# Altium schematic sheet Sheet2.SchDoc
size A; SheetNumber: 1; SheetTotal: 2
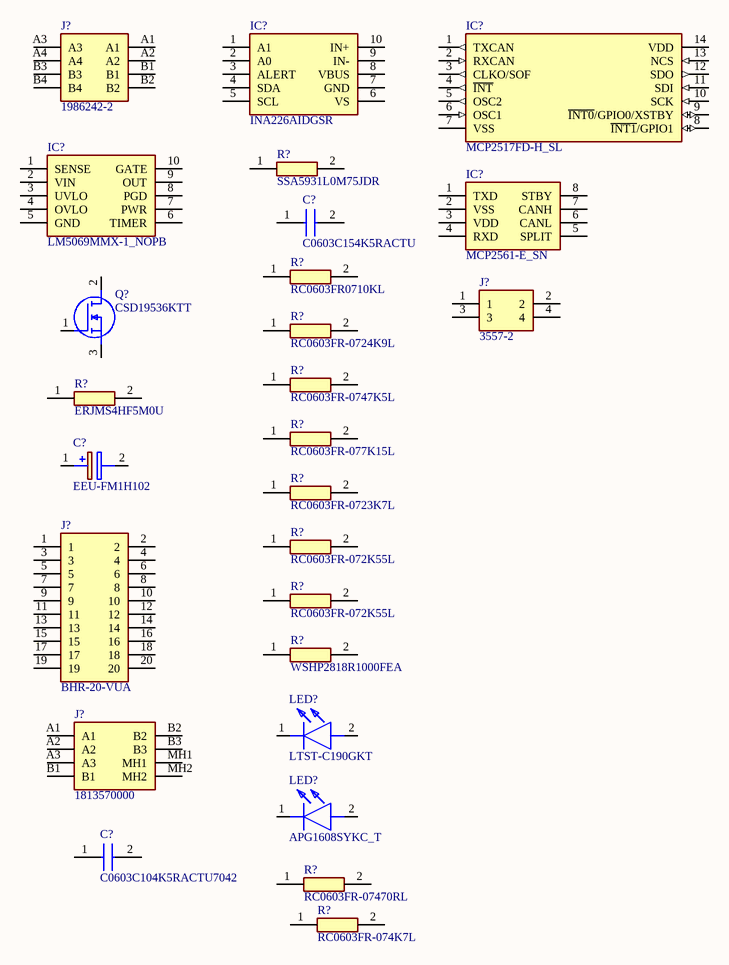
[diagram p0: Sheet2.SchDoc]

## Parts
(Parts that share a designator on the sheet are numbered #1, #2 ... from top to bottom, then left to right.)
C?#1  C0603C154K5RACTU  [C0603]
C?#2  EEU-FM1H102  [CAPPRD750W85D1600H2700]
C?#3  C0603C104K5RACTU7042  [CAPC1608X95N]
IC?#1  INA226AIDGSR  [SOP50P490X110-10N]
IC?#2  MCP2517FD-H_SL  [SOIC127P600X175-14N]
IC?#3  LM5069MMX-1_NOPB  [SOP50P490X110-10N]
IC?#4  MCP2561-E_SN  [SOIC127P600X175-8N]
J?#1  1986242-2  [19862422]
J?#2  3557-2  [3557-2]
J?#3  BHR-20-VUA  [SHDR20W64P254_2X10_3300X880X910P]
J?#4  1813570000  [1813570000]
LED?#1  LTST-C190GKT  [LEDC1608X90N]
LED?#2  APG1608SYKC_T  [APG1608SYKCT]
Q?  CSD19536KTT  [CSD19536KTTT]
R?#1  SSA5931L0M75JDR  [SSA5931L0M75JDR]
R?#2  RC0603FR0710KL  [RESC1608X55N]
R?#3  RC0603FR-0724K9L  [RESC1608X55N]
R?#4  RC0603FR-0747K5L  [RESC1608X55N]
R?#5  ERJMS4HF5M0U  [RESC6432X135N]
R?#6  RC0603FR-077K15L  [RESC1608X55N]
R?#7  RC0603FR-0723K7L  [RESC1608X55N]
R?#8  RC0603FR-072K55L  [RESC1608X55N]
R?#9  RC0603FR-072K55L  [RESC1608X55N]
R?#10  WSHP2818R1000FEA  [WSHP2818R0200FEA]
R?#11  RC0603FR-07470RL  [RESC1608X55N]
R?#12  RC0603FR-074K7L  [RESC1608X55N]

## Nets

Not connected (* = marked no-connect by the designer): C?#1 1 2; C?#2 1(+) 2(-); C?#3 1 2; IC?#1 1(A1) 2(A0) 3(ALERT) 4(SDA) 5(SCL) 6(VS) 7(GND) 8(VBUS) 9(IN-) 10(IN+); IC?#2 1(TXCAN) 2(RXCAN) 3(CLKO/SOF) 4(~{INT}) 5(OSC2) 6(OSC1) 7(VSS) 8(~{INT1}/GPIO1) 9(~{INT0}/GPIO0/XSTBY) 10(SCK) 11(SDI) 12(SDO) 13(NCS) 14(VDD); IC?#3 1(SENSE) 2(VIN) 3(UVLO) 4(OVLO) 5(GND) 6(TIMER) 7(PWR) 8(PGD) 9(OUT) 10(GATE); IC?#4 1(TXD) 2(VSS) 3(VDD) 4(RXD) 5(SPLIT) 6(CANL) 7(CANH) 8(STBY); J?#1 A1 A2 A3 A4 B1 B2 B3 B4; J?#2 1 2 3 4; J?#3 1 2 3 4 5 6 7 8 9 10 11 12 13 14 15 16 17 18 19 20; J?#4 A1 A2 A3 B1 B2 B3 MH1 MH2; LED?#1 1(K) 2(A); LED?#2 1(K) 2(A); Q? 1(G) 2(D) 3(S); R?#1 1 2; R?#2 1 2; R?#3 1 2; R?#4 1 2; R?#5 1 2; R?#6 1 2; R?#7 1 2; R?#8 1 2; R?#9 1 2; R?#10 1 2; R?#11 1 2; R?#12 1 2

## Library data of the parts
C?#1 = C0603C154K5RACTU: Capacitor; Manufacturer_Name: KEMET; Datasheet Link: https://content.kemet.com/datasheets/KEM_C1002_X7R_SMD.pdf; Height: 0.87mm; Manufacturer_Part_Number: C0603C154K5RACTU; Mouser Part Number: 80-C0603C154K5R; Mouser Price/Stock: https://www.mouser.co.uk/ProductDetail/KEMET/C0603C154K5RACTU?qs=1fdy9CdgnoTOxUP11Cz%2FMw%3D%3D; Arrow Part Number: C0603C154K5RACTU; Arrow Price/Stock: https://www.arrow.com/en/products/c0603c154k5ractu/kemet-corporation
C?#2 = EEU-FM1H102: Capacitor Polarised; Manufacturer_Name: Panasonic; Datasheet Link: http://industrial.panasonic.com/cdbs/www-data/pdf/RDF0000/ABA0000C1018.pdf; Height: 27mm; Manufacturer_Part_Number: EEU-FM1H102; Mouser Part Number: 667-EEU-FM1H102; Mouser Price/Stock: https://www.mouser.co.uk/ProductDetail/Panasonic/EEU-FM1H102?qs=zRgoiOxxqPKLOuQ%2FWAJo1g%3D%3D; Arrow Part Number: EEU-FM1H102; Arrow Price/Stock: https://www.arrow.com/en/products/eeu-fm1h102/panasonic
C?#3 = C0603C104K5RACTU7042: Capacitor; Manufacturer_Name: KEMET; Datasheet Link: https://www.arrow.com/en/products/c0603c104k5ractu7042/kemet-corporation; Height: 0.95mm; Manufacturer_Part_Number: C0603C104K5RACTU7042; Arrow Part Number: C0603C104K5RACTU7042; Arrow Price/Stock: https://www.arrow.com/en/products/c0603c104k5ractu7042/kemet-corporation
IC?#1 = INA226AIDGSR: Integrated Circuit; Manufacturer_Name: Texas Instruments; Datasheet Link: https://componentsearchengine.com/Datasheets/1/INA226AIDGSR.pdf; Height: 1.1mm; Manufacturer_Part_Number: INA226AIDGSR; Mouser Part Number: 595-INA226AIDGSR; Mouser Price/Stock: https://www.mouser.co.uk/ProductDetail/Texas-Instruments/INA226AIDGSR?qs=tQG3bEuiOZD4quG3egR36g%3D%3D; Arrow Part Number: INA226AIDGSR; Arrow Price/Stock: https://www.arrow.com/en/products/ina226aidgsr/texas-instruments?region=nac
IC?#2 = MCP2517FD-H_SL: Integrated Circuit; Manufacturer_Name: Microchip; Manufacturer_Part_Number: MCP2517FD-H/SL; Datasheet Link: https://componentsearchengine.com/Datasheets/2/MCP2517FD-H_SL.pdf; Height: 1.75mm; Mouser Part Number: 579-MCP2517FD-H/SL; Mouser Price/Stock: https://www.mouser.co.uk/ProductDetail/Microchip-Technology/MCP2517FD-H-SL?qs=HXFqYaX1Q2z%252BNRuEes7E5A%3D%3D; Arrow Part Number: MCP2517FD-H/SL; Arrow Price/Stock: https://www.arrow.com/en/products/mcp2517fd-hsl/microchip-technology?region=nac
IC?#3 = LM5069MMX-1_NOPB: Integrated Circuit; Manufacturer_Name: Texas Instruments; Manufacturer_Part_Number: LM5069MMX-1/NOPB; Datasheet Link: http://www.ti.com/lit/gpn/LM5069; Height: 1.1mm; Mouser Part Number: 926-LM5069MMX-1/NOPB; Mouser Price/Stock: https://www.mouser.co.uk/ProductDetail/Texas-Instruments/LM5069MMX-1-NOPB?qs=QbsRYf82W3F2vxtHa3yE4Q%3D%3D; Arrow Part Number: LM5069MMX-1/NOPB; Arrow Price/Stock: https://www.arrow.com/en/products/lm5069mmx-1nopb/texas-instruments?utm_currency=USD&region=nac
IC?#4 = MCP2561-E_SN: Integrated Circuit; Manufacturer_Name: Microchip; Manufacturer_Part_Number: MCP2561-E/SN; Datasheet Link: http://uk.rs-online.com/web/p/products/7990216; Height: 1.75mm; Mouser Part Number: 579-MCP2561-E/SN; Mouser Price/Stock: https://www.mouser.co.uk/ProductDetail/Microchip-Technology/MCP2561-E-SN?qs=6qKXPk0vzx28OXZ8VYnZ2A%3D%3D; Arrow Part Number: MCP2561-E/SN; Arrow Price/Stock: https://www.arrow.com/en/products/mcp2561-esn/microchip-technology?utm_currency=USD&region=nac
J?#1 = 1986242-2: Connector; Manufacturer_Name: TE Connectivity; Datasheet Link: https://www.te.com/commerce/DocumentDelivery/DDEController?Action=srchrtrv&DocNm=9-1773451-7_HIGH_POWER_TERMINAL_BLOCKS&DocType=Data%20Sheet&DocLang=English&PartCntxt=1986242-2&DocFormat=pdf; Height: 39.3mm; Manufacturer_Part_Number: 1986242-2; Mouser Part Number: 571-1986242-2; Mouser Price/Stock: https://www.mouser.co.uk/ProductDetail/TE-Connectivity/1986242-2?qs=GE1PmMuiY3hF13Nzyur9lw%3D%3D; Arrow Part Number: 1986242-2; Arrow Price/Stock: https://www.arrow.com/en/products/1986242-2/te-connectivity?region=nac
J?#2 = 3557-2: Connector; Manufacturer_Name: Keystone Electronics; Datasheet Link: http://www.keyelco.com/product-pdf.cfm?p=296; Manufacturer_Part_Number: 3557-2; Mouser Part Number: 534-3557-2; Mouser Price/Stock: https://www.mouser.co.uk/ProductDetail/Keystone-Electronics/3557-2?qs=cxy41lVAGV%2FfbyASjpXK1g%3D%3D; Arrow Part Number: 3557-2; Arrow Price/Stock: https://www.arrow.com/en/products/3557-2/keystone-electronics?region=europe
J?#3 = BHR-20-VUA: Connector; Manufacturer_Name: Adam Tech; Datasheet Link: https://datasheet.datasheetarchive.com/originals/distributors/Datasheets_SAMA/695a8166aa40898d0a6b5857fa89f6fe.pdf; Height: 9.1mm; Manufacturer_Part_Number: BHR-20-VUA; Mouser Part Number: 737-BHR-20-VUA; Mouser Price/Stock: https://www.mouser.co.uk/ProductDetail/Adam-Tech/BHR-20-VUA?qs=dR34hP2JS5AwmTi%252BypH%252BNg%3D%3D; Arrow Part Number: BHR-20-VUA; Arrow Price/Stock: https://www.arrow.com/en/products/bhr-20-vua/adam-tech?utm_currency=USD&region=nac
J?#4 = 1813570000: Connector; Manufacturer_Name: Weidmuller; Datasheet Link: https://catalog.weidmueller.com/catalog/Start.do?ObjectID=1813570000&_ga=2.122577868.610284068.1671419062-1938212839.1670815619&_gl=1*1ghlydi*_ga*MTkzODIxMjgzOS4xNjcwODE1NjE5*_ga_276D8EYXDF*MTY3MTUwNTUzNy4yMi4xLjE2NzE1MDg2NTMuMC4wLjA.; Height: 13.6mm; Manufacturer_Part_Number: 1813570000
LED?#1 = LTST-C190GKT: LED; Manufacturer_Name: Lite-On; Datasheet Link: https://media.digikey.com/pdf/Data%20Sheets/Lite-On%20PDFs/LTST-C190GKT.pdf; Height: 0.9mm; Manufacturer_Part_Number: LTST-C190GKT; Mouser Part Number: 859-LTST-C190GKT; Mouser Price/Stock: https://www.mouser.co.uk/ProductDetail/LITEON/LTST-C190GKT?qs=drxkyCeiWgbQzclgbojDOg%3D%3D; Arrow Part Number: LTST-C190GKT; Arrow Price/Stock: https://www.arrow.com/en/products/ltst-c190gkt/lite-on-technology?utm_currency=USD&region=nac
LED?#2 = APG1608SYKC_T: LED; Manufacturer_Name: Kingbright; Manufacturer_Part_Number: APG1608SYKC/T; Datasheet Link: https://www.kingbrightusa.com/images/catalog/SPEC/APG1608SYKC-T.pdf; Height: 0.28mm; Mouser Part Number: 604-APG1608SYKC/T; Mouser Price/Stock: https://www.mouser.co.uk/ProductDetail/Kingbright/APG1608SYKC-T?qs=uxmOeTEqoPwi1baBMiknXw%3D%3D; Arrow Part Number: APG1608SYKC/T; Arrow Price/Stock: https://www.arrow.com/en/products/apg1608sykct/kingbright
Q? = CSD19536KTT: MOSFET (N-Channel); Manufacturer_Name: Texas Instruments; Datasheet Link: http://www.ti.com/lit/gpn/csd19536ktt; Manufacturer_Part_Number: CSD19536KTT; Mouser Part Number: 595-CSD19536KTT; Mouser Price/Stock: https://www.mouser.co.uk/ProductDetail/Texas-Instruments/CSD19536KTT?qs=MiqG6Kq1qKP2NIsb3jZrDg%3D%3D; Arrow Part Number: CSD19536KTT; Arrow Price/Stock: https://www.arrow.com/en/products/csd19536ktt/texas-instruments?region=nac
R?#1 = SSA5931L0M75JDR: Resistor; Manufacturer_Name: LITTELFUSE; Datasheet Link: https://www.littelfuse.com/media?resourcetype=datasheets&itemid=70d56cd7-0fc3-4a62-93c9-7bee8cc82f45&filename=littelfuse-current-shunt-resistor-ssa-datasheet; Height: 0.38mm; Manufacturer_Part_Number: SSA5931L0M75JDR
R?#2 = RC0603FR0710KL: Resistor; Manufacturer_Name: KEMET; Datasheet Link: http://www.yageo.com/documents/recent/PYu-RC0603_51_RoHS_L_v5.pdf; Height: 0.55mm; Manufacturer_Part_Number: RC0603FR0710KL; Arrow Part Number: RC0603FR0710KL; Arrow Price/Stock: https://www.arrow.com/en/products/rc0603fr-0710kl/yageo
R?#3 = RC0603FR-0724K9L: Resistor; Manufacturer_Name: YAGEO; Datasheet Link: https://componentsearchengine.com/Datasheets/2/RC0603FR-0724K9L.pdf; Height: 0.55mm; Manufacturer_Part_Number: RC0603FR-0724K9L; Mouser Part Number: 603-RC0603FR-0724K9L; Mouser Price/Stock: https://www.mouser.co.uk/ProductDetail/YAGEO/RC0603FR-0724K9L?qs=diQw95jMAeOCjvc8VIQQfA%3D%3D
R?#4 = RC0603FR-0747K5L: Resistor; Manufacturer_Name: KEMET; Datasheet Link: http://www.yageo.com/documents/recent/PYu-RC0603_51_RoHS_L_v5.pdf; Height: 0.55mm; Manufacturer_Part_Number: RC0603FR-0747K5L; Mouser Part Number: 603-RC0603FR-0747K5L; Mouser Price/Stock: https://www.mouser.co.uk/ProductDetail/YAGEO/RC0603FR-0747K5L?qs=gt6vzsuosg1%252Bk7pUJwAM9w%3D%3D; Arrow Part Number: RC0603FR-0747K5L; Arrow Price/Stock: https://www.arrow.com/en/products/rc0603fr-0747k5l/yageo?region=europe
R?#5 = ERJMS4HF5M0U: Resistor; Manufacturer_Name: Panasonic; Datasheet Link: https://industrial.panasonic.com/cdbs/www-data/pdf/RDN0000/AOA0000C319.pdf; Height: 1.35mm; Manufacturer_Part_Number: ERJMS4HF5M0U
R?#6 = RC0603FR-077K15L: Resistor; Manufacturer_Name: KEMET; Datasheet Link: http://www.yageo.com/documents/recent/PYu-RC0603_51_RoHS_L_v5.pdf; Height: 0.55mm; Manufacturer_Part_Number: RC0603FR-077K15L; Mouser Part Number: 603-RC0603FR-077K15L; Mouser Price/Stock: https://www.mouser.co.uk/ProductDetail/YAGEO/RC0603FR-077K15L?qs=2cAdsCoAWRH0BxijgDyAtA%3D%3D; Arrow Part Number: RC0603FR-077K15L; Arrow Price/Stock: https://www.arrow.com/en/products/rc0603fr-077k15l/yageo?region=nac
R?#7 = RC0603FR-0723K7L: Resistor; Manufacturer_Name: KEMET; Datasheet Link: http://www.yageo.com/documents/recent/PYu-RC0603_51_RoHS_L_v5.pdf; Height: 0.55mm; Manufacturer_Part_Number: RC0603FR-0723K7L; Mouser Part Number: 603-RC0603FR-0723K7L; Mouser Price/Stock: https://www.mouser.co.uk/ProductDetail/Yageo/RC0603FR-0723K7L/?qs=diQw95jMAeNvW01KGekl2w%3D%3D
R?#8 R?#9 = RC0603FR-072K55L: Resistor; Manufacturer_Name: KEMET; Datasheet Link: http://www.yageo.com/documents/recent/PYu-RC0603_51_RoHS_L_v5.pdf; Height: 0.55mm; Manufacturer_Part_Number: RC0603FR-072K55L; Mouser Part Number: 603-RC0603FR-072K55L; Mouser Price/Stock: https://www.mouser.com/Search/Refine.aspx?Keyword=603-RC0603FR-072K55L
R?#10 = WSHP2818R1000FEA: Resistor; Manufacturer_Name: Vishay; Datasheet Link: https://www.vishay.com/docs/30347/wshp2818.pdf; Height: 1.75mm; Manufacturer_Part_Number: WSHP2818R1000FEA; Mouser Part Number: 71-WSHP2818R1000FEA; Mouser Price/Stock: https://www.mouser.co.uk/ProductDetail/Vishay-Dale/WSHP2818R1000FEA?qs=WY0B%252Bpw29jMhv12f1sGakg%3D%3D; Arrow Part Number: WSHP2818R1000FEA; Arrow Price/Stock: https://www.arrow.com/en/products/wshp2818r1000fea/vishay?utm_currency=USD&region=nac
R?#11 = RC0603FR-07470RL: Resistor; Manufacturer_Name: KEMET; Datasheet Link: http://www.yageo.com/documents/recent/PYu-RC0603_51_RoHS_L_v5.pdf; Height: 0.55mm; Manufacturer_Part_Number: RC0603FR-07470RL; Mouser Part Number: 603-RC0603FR-07470RL; Mouser Price/Stock: https://www.mouser.co.uk/ProductDetail/YAGEO/RC0603FR-07470RL?qs=gt6vzsuosg2Xv5elfMBXPA%3D%3D
R?#12 = RC0603FR-074K7L: Resistor; Manufacturer_Name: YAGEO; Datasheet Link: https://componentsearchengine.com/Datasheets/2/RC0603FR-074K7L.pdf; Height: 0.55mm; Manufacturer_Part_Number: RC0603FR-074K7L; Mouser Part Number: 603-RC0603FR-074K7L; Mouser Price/Stock: https://www.mouser.co.uk/ProductDetail/YAGEO/RC0603FR-074K7L?qs=gt6vzsuosg37y0l7Vt36bQ%3D%3D; Arrow Part Number: RC0603FR-074K7L; Arrow Price/Stock: https://www.arrow.com/en/products/rc0603fr-074k7l/yageo?utm_currency=USD&region=europe